# EAGLE design CPU_module (EAGLE 6.2)
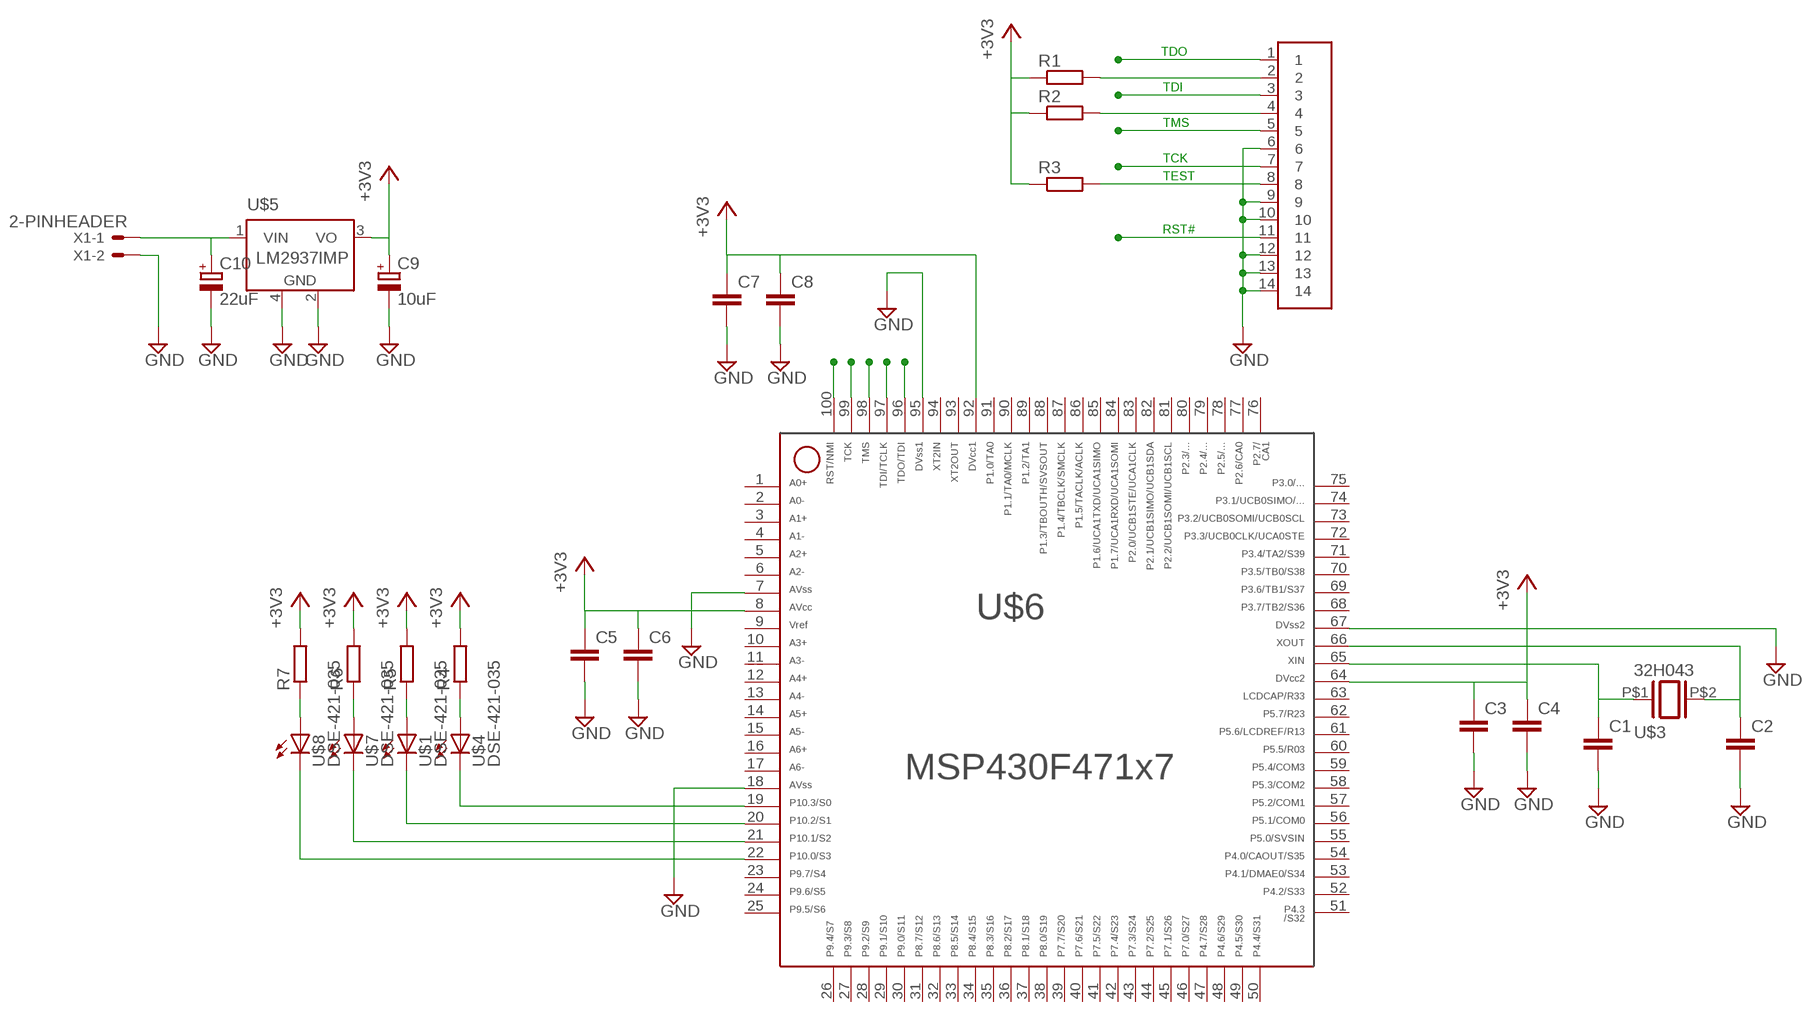
[diagram p0: schematic, sheet 1]

## Parts
C1  C-EUC0402  [C0402]
C2  C-EUC0402  [C0402]
C3  C-EUC0402  [C0402]
C4  C-EUC0402  [C0402]
C5  C-EUC0402  [C0402]
C6  C-EUC0402  [C0402]
C7  C-EUC0402  [C0402]
C8  C-EUC0402  [C0402]
C9  10uF  CPOL-EUSMCC  [SMC_C]
C10  22uF  CPOL-EUSMCD  [SMC_D]
R1  R-EU_R0402  [R0402]
R2  R-EU_R0402  [R0402]
R3  R-EU_R0402  [R0402]
R4  R-EU_R0402  [R0402]
R5  R-EU_R0402  [R0402]
R6  R-EU_R0402  [R0402]
R7  R-EU_R0402  [R0402]
U$1  DSE-421-035  [2432]
U$2  2X7SMD_HEADER  [2X14SMDPADS]
U$3  32H043  [XTAL-SMALL-4]
U$4  DSE-421-035  [2432]
U$5  LM2937IMP  [SOT223]
U$6  F471X7---PZ100  [PZ100]
U$7  DSE-421-035  [2432]
U$8  DSE-421-035  [2432]
X1  2-PINHEADER  [22-23-2021]

## Nets
+3V3: C3.1 C4.1 C5.1 C6.1 C7.1 C8.1 C9.+ R1.1 R2.1 R3.1 R4.2 R5.2 R6.2 R7.2 U$5.3(VO) U$6.8 U$6.64 U$6.92
GND: C1.2 C2.2 C3.2 C4.2 C5.2 C6.2 C7.2 C8.2 C9.- C10.- U$2.6 U$2.9 U$2.10 U$2.12 U$2.13 U$2.14 U$5.2(GND) U$5.4(GND) U$6.7 U$6.18 U$6.67 U$6.95 X1.2
N$1: R1.2 U$2.2
N$2: C1.1 U$3.P$1 U$6.65
N$3: C2.1 U$3.P$2 U$6.66
N$4: R2.2 U$2.4
N$5: U$6.22 U$8.MARKED(C)
N$6: U$6.21 U$7.MARKED(C)
N$7: U$1.MARKED(C) U$6.20
N$8: U$4.MARKED(C) U$6.19
N$9: R7.1 U$8.P$1(A)
N$10: R6.1 U$7.P$1(A)
N$11: R5.1 U$1.P$1(A)
N$12: R4.1 U$4.P$1(A)
N$13: C10.+ U$5.1(VIN) X1.1
RST#: U$2.11 U$6.100
TCK: U$2.7 U$6.99
TDI: U$2.3 U$6.97
TDO: U$2.1 U$6.96
TEST: R3.2 U$2.8
TMS: U$2.5 U$6.98
Unconnected: U$6.1 U$6.2 U$6.3 U$6.4 U$6.5 U$6.6 U$6.9 U$6.10 U$6.11 U$6.12 U$6.13 U$6.14 U$6.15 U$6.16 U$6.17 U$6.23 U$6.24 U$6.25 U$6.26 U$6.27 U$6.28 U$6.29 U$6.30 U$6.31 U$6.32 U$6.33 U$6.34 U$6.35 U$6.36 U$6.37 U$6.38 U$6.39 U$6.40 U$6.41 U$6.42 U$6.43 U$6.44 U$6.45 U$6.46 U$6.47 U$6.48 U$6.49 U$6.50 U$6.51 U$6.52 U$6.53 U$6.54 U$6.55 U$6.56 U$6.57 U$6.58 U$6.59 U$6.60 U$6.61 U$6.62 U$6.63 U$6.68 U$6.69 U$6.70 U$6.71 U$6.72 U$6.73 U$6.74 U$6.75 U$6.76 U$6.77 U$6.78 U$6.79 U$6.80 U$6.81 U$6.82 U$6.83 U$6.84 U$6.85 U$6.86 U$6.87 U$6.88 U$6.89 U$6.90 U$6.91 U$6.93 U$6.94

## Notes on the sheet
- TDO
- TDI
- TMS
- TCK
- TEST
- RST#

## Library data of the parts
C1-C8 = rcl:C-EU: CAPACITOR, European symbol
C9 C10 = rcl:CPOL-EU: POLARIZED CAPACITOR, European symbol
R1-R7 = rcl:R-EU_: RESISTOR, European symbol
U$1 U$4 U$7 U$8 = synth_design:DSE-421-035
U$2 = synth_design:2X7SMD_HEADER
U$3 = synth_design:32H043
U$5 = synth_design:LM2937IMP
U$6 = TI_MSP430_v16:F471X7---PZ100: ***MSP430F471x7***PZ100
X1 = Custom_headers:2-PINHEADER: .100" (2.54mm) Center Header - 2 Pin; MF: MOLEX; MPN: 22-23-2021; OC_FARNELL: 1462926; OC_NEWARK: 25C3832

## Board
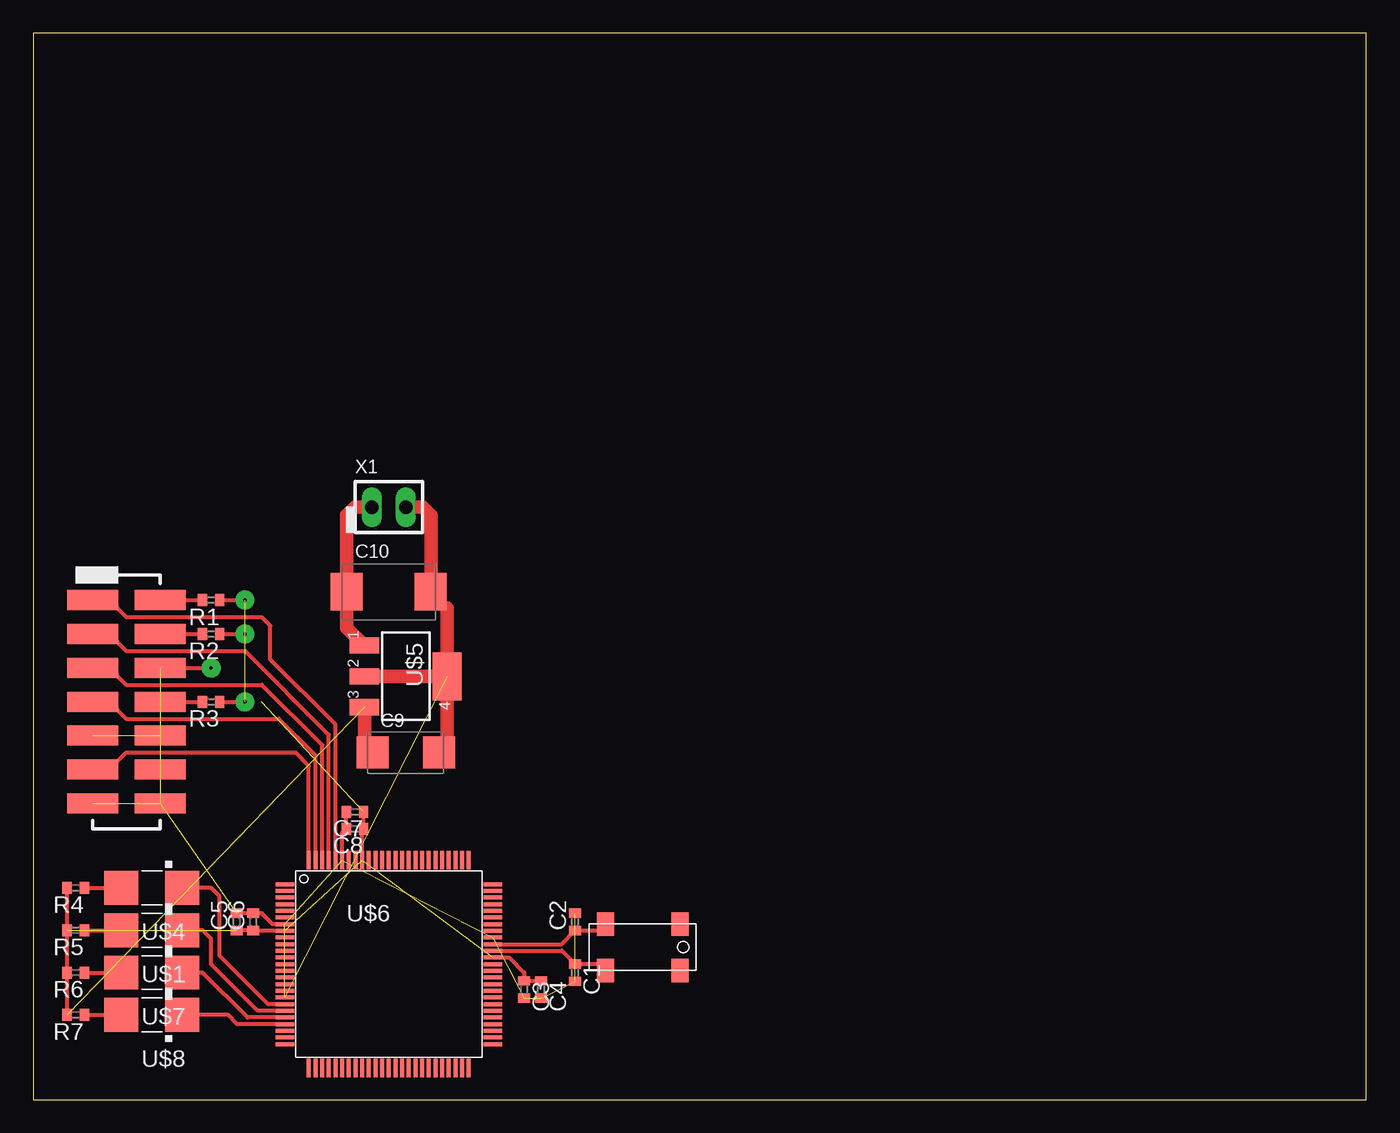
[diagram p1: board, top side]
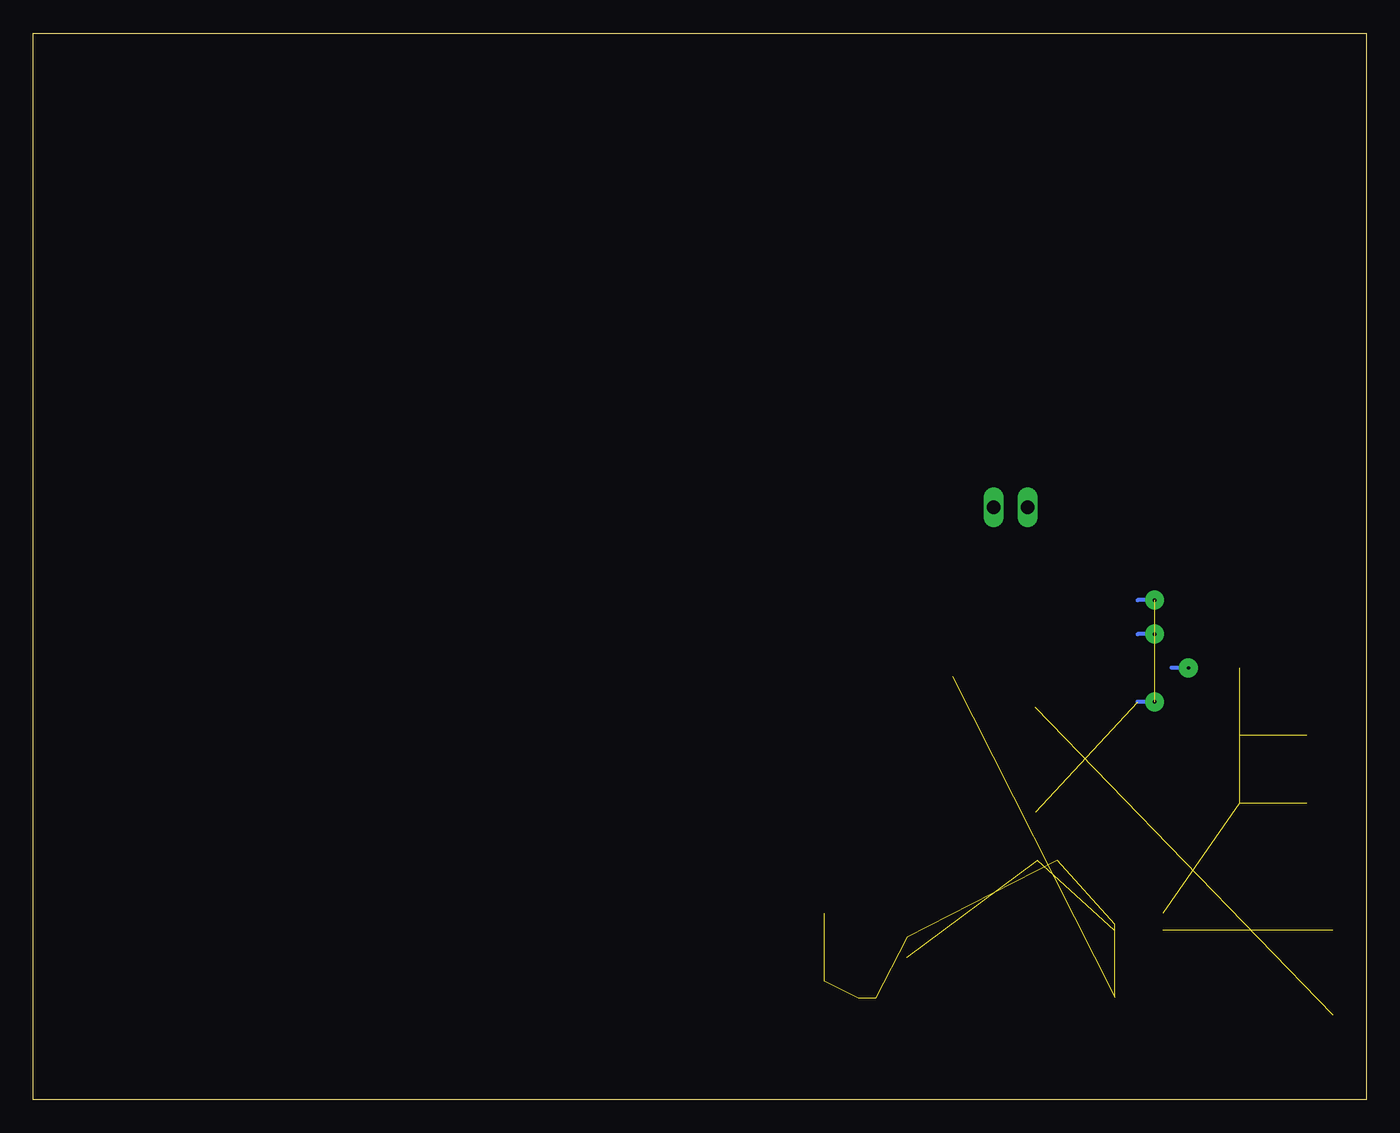
[diagram p2: board, bottom side, seen from below]

Size 100 x 80 mm. Coordinates in mm from the lower left corner, seen from the top.
Outline: 0,0 100,0 100,80 0,80 0,0
Copper layers (1*16): Top 0.035mm / dielectric 1.5mm / Bottom 0.035mm
Design rules: minimum track width 10mil, minimum drill 24mil, track to track 8mil, track to pad 8mil, pad to pad 8mil, via to via 8mil, smd to smd 8mil, copper to edge 40mil, drill to drill 8mil, minimum pad ring 10mil, minimum via ring 8mil, stop-mask expansion 4mil, vias tented up to drill 0mil, thermal gap 10mil

### Footprints (pad centres in the part's own frame; a part is rotated, then mirrored left to right if it is on the bottom)
C0402 = smd 0.7 x 0.9: 1 -0.65,0; 2 0.65,0
SMC_C = smd 2.4 x 2.4: + -2.5,0; - 2.5,0
SMC_D = smd 2.4 x 2.8: + -3.15,0; - 3.15,0
R0402 = smd 0.7 x 0.9: 1 -0.65,0; 2 0.65,0
2432 = smd 2.54 x 2.54: MARKED 2.286,0; P$1 -2.286,0
2X14SMDPADS = smd 3.81 x 1.499: 1 -2.54,7.62; 2 2.54,7.62; 3 -2.54,5.08; 4 2.54,5.08; 5 -2.54,2.54; 6 2.54,2.54; 7 -2.54,0; 8 2.54,0; 9 -2.54,-2.54; 10 2.54,-2.54; 11 -2.54,-5.08; 12 2.54,-5.08; 13 -2.54,-7.62; 14 2.54,-7.62
XTAL-SMALL-4 = smd 1.778 x 1.295: NC1 -1.753,-2.794; NC2 1.727,-2.794; P$1 -1.753,2.794; P$2 1.727,2.794
SOT223 = smd 1.219 x 2.235: 1 -2.311,-3.099; 2 0,-3.099; 3 2.311,-3.099 | smd 3.6 x 2.2: 4 0,3.099
PZ100 = smd 1.4 x 0.3: 1 -7.8,6; 2 -7.8,5.5; 3 -7.8,5; 4 -7.8,4.5; 5 -7.8,4; 6 -7.8,3.5; 7 -7.8,3; 8 -7.8,2.5; 9 -7.8,2; 10 -7.8,1.5; 11 -7.8,1; 12 -7.8,0.5; 13 -7.8,0; 14 -7.8,-0.5; 15 -7.8,-1; 16 -7.8,-1.5; 17 -7.8,-2; 18 -7.8,-2.5; 19 -7.8,-3; 20 -7.8,-3.5; 21 -7.8,-4; 22 -7.8,-4.5; 23 -7.8,-5; 24 -7.8,-5.5; 25 -7.8,-6; 51 7.8,-6; 52 7.8,-5.5; 53 7.8,-5; 54 7.8,-4.5; 55 7.8,-4; 56 7.8,-3.5; 57 7.8,-3; 58 7.8,-2.5; 59 7.8,-2; 60 7.8,-1.5; 61 7.8,-1; 62 7.8,-0.5; 63 7.8,0; 64 7.8,0.5; 65 7.8,1; 66 7.8,1.5; 67 7.8,2; 68 7.8,2.5; 69 7.8,3; 70 7.8,3.5; 71 7.8,4; 72 7.8,4.5; 73 7.8,5; 74 7.8,5.5; 75 7.8,6 | smd 0.3 x 1.4: 26 -6,-7.8; 27 -5.5,-7.8; 28 -5,-7.8; 29 -4.5,-7.8; 30 -4,-7.8; 31 -3.5,-7.8; 32 -3,-7.8; 33 -2.5,-7.8; 34 -2,-7.8; 35 -1.5,-7.8; 36 -1,-7.8; 37 -0.5,-7.8; 38 0,-7.8; 39 0.5,-7.8; 40 1,-7.8; 41 1.5,-7.8; 42 2,-7.8; 43 2.5,-7.8; 44 3,-7.8; 45 3.5,-7.8; 46 4,-7.8; 47 4.5,-7.8; 48 5,-7.8; 49 5.5,-7.8; 50 6,-7.8; 76 6,7.8; 77 5.5,7.8; 78 5,7.8; 79 4.5,7.8; 80 4,7.8; 81 3.5,7.8; 82 3,7.8; 83 2.5,7.8; 84 2,7.8; 85 1.5,7.8; 86 1,7.8; 87 0.5,7.8; 88 0,7.8; 89 -0.5,7.8; 90 -1,7.8; 91 -1.5,7.8; 92 -2,7.8; 93 -2.5,7.8; 94 -3,7.8; 95 -3.5,7.8; 96 -4,7.8; 97 -4.5,7.8; 98 -5,7.8; 99 -5.5,7.8; 100 -6,7.8
22-23-2021 = drill 1 long: 1 -1.27,0; 2 1.27,0

### Placement (x,y rotation side)
C1  40.64,9.53 270 top
C2  40.64,13.34 90 top
C3  36.83,8.26 270 top
C4  38.1,8.26 270 top
C5  15.24,13.34 90 top
C6  16.51,13.34 90 top
C7  24.13,21.59 180 top
C8  24.13,20.32 180 top
C9  27.94,26.04 0 top
C10  26.67,38.1 0 top
R1  13.34,37.47 180 top
R2  13.34,34.92 180 top
R3  13.34,29.84 180 top
R4  3.17,15.88 180 top
R5  3.17,12.7 180 top
R6  3.17,9.53 180 top
R7  3.17,6.35 180 top
U$1  8.89,12.7 0 top
U$2  6.99,29.84 0 top
U$3  45.72,11.43 90 top
U$4  8.89,15.88 0 top
U$5  27.94,31.75 270 top
U$6  26.67,10.16 0 top
U$7  8.89,9.53 0 top
U$8  8.89,6.35 0 top
X1  26.67,44.45 0 top

### Tracks (layer width: path | path; a pad name or v marks a point on that pad's centre or on a via)
+3V3  (via drill 0.25 pad 1.42)  (7 unrouted)
  Top 0.305: R7.2 R6.2 R5.2 R4.2 | C5.1 C6.1 18.84,12.69 U$6.8 | U$6.64 35.7,10.66 36.83,9.53 C3.1 C4.1 | R1.1 v15.88,37.47 | R2.1 v15.88,34.92 | R3.1 v15.88,29.84 | U$6.92 24.67,20.21 C8.1 C7.1 | C9.+ 24.84,26.63
  Top 1.016: 24.84,26.63 U$5.3
  Bottom 0.305: v15.88,37.47 17.14,37.47 | v15.88,34.92 17.14,34.92 | v15.88,29.84 17.14,29.84
GND  (via drill 0.25 pad 1.42)  (14 unrouted)
  Top 0.305: U$6.7 17.95,13.16 17.14,13.97 16.52,13.97 C6.2 C5.2 | U$2.6 v13.34,32.38 | U$6.95 23.17,20.01 C8.2 C7.2 | 29.84,38.12 C10.- 31.04,36.88 | C9.- 31.04,26.63
  Top 1.016: X1.2 29.21,44.45 29.84,43.81 29.84,38.12 | 31.04,36.88 U$5.4 | U$5.2 U$5.4 | 31.04,26.63 U$5.4
  Bottom 0.305: v13.34,32.38 14.61,32.38
N$1
  Top 0.305: U$2.2 R1.2
N$2
  Top 0.305: U$3.P$1 42.43,10.18 C1.1 39.66,11.16 U$6.65
N$3
  Top 0.305: U$3.P$2 42.45,12.69 C2.1 39.62,11.66 U$6.66
N$4
  Top 0.305: U$2.4 R2.2
N$5
  Top 0.305: U$6.22 15.29,5.66 14.61,6.35 U$8.MARKED
N$6
  Top 0.305: U$6.21 16.07,6.16 12.7,9.53 U$7.MARKED
N$7
  Top 0.305: U$6.20 16.84,6.66 13.34,10.16 13.34,12.06 12.7,12.7 U$1.MARKED
N$8
  Top 0.305: U$6.19 17.61,7.16 13.97,10.79 13.97,15.24 13.34,15.88 U$4.MARKED
N$9
  Top 0.305: R7.1 U$8.P$1
N$10
  Top 0.305: R6.1 U$7.P$1
N$11
  Top 0.305: R5.1 U$1.P$1
N$12
  Top 0.305: R4.1 U$4.P$1
N$13
  Top 1.016: X1.1 24.13,44.45 23.52,43.84 C10.+ 23.52,35.38 U$5.1
RST#
  Top 0.305: U$2.11 5.71,24.77 6.99,26.04 19.68,26.04 20.67,25.05 U$6.100
TCK
  Top 0.305: U$2.7 5.71,29.84 6.99,28.57 18.41,28.57 21.17,25.82 U$6.99
TDI
  Top 0.305: U$2.3 5.71,34.92 6.99,33.66 15.88,33.66 22.17,27.36 U$6.97
TDO
  Top 0.305: U$2.1 5.71,37.47 6.99,36.2 17.14,36.2 17.78,35.56 17.78,33.02 22.67,28.13 U$6.96
TEST
  Top 0.305: U$2.8 R3.2
TMS
  Top 0.305: U$2.5 5.71,32.38 6.99,31.11 17.14,31.11 21.67,26.59 U$6.98